# Altium project PCB_Project1.PrjPCB
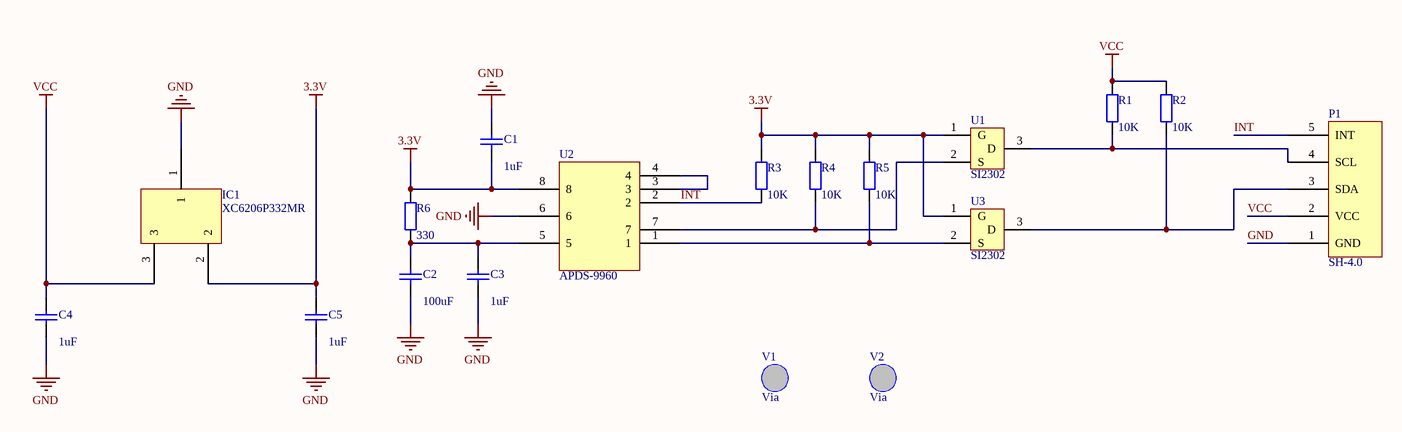
[diagram p0: Sheet1.SchDoc]
1 sheet, 18 parts. Net scope: global (net labels, ports and power ports of the same name join across sheets).
Board file: PCB1.PcbDoc

## Sheet Sheet1.SchDoc
size A4

### Parts
C1  value 1uF  [1608[0603]]  (hidden comment: Cap Semi)
C2  value 100uF  [C2512]  (hidden comment: Cap Semi)
C3  value 1uF  [1608[0603]]  (hidden comment: Cap Semi)
C4  value 1uF  [1608[0603]]  (hidden comment: Cap Semi)
C5  value 1uF  [1608[0603]]  (hidden comment: Cap Semi)
IC1  XC6206P332MR  [SOT-23]
P1  SH-4.0  [SH-4.0]
R1  value 10K  [1608[0603]]  (hidden comment: Res2)
R2  value 10K  [1608[0603]]  (hidden comment: Res2)
R3  value 10K  [1608[0603]]  (hidden comment: Res2)
R4  value 10K  [1608[0603]]  (hidden comment: Res2)
R5  value 10K  [1608[0603]]  (hidden comment: Res2)
R6  value 330  [1608[0603]]  (hidden comment: Res2)
U1  SI2302  [SOT-23]
U2  APDS-9960  [APDS-9960]
U3  SI2302  [SOT-23]
V1  Via  [Via]
V2  Via  [Via]

### Nets
3.3V: C1.2 C5.1 IC1.2 R3.2 R4.2 R5.2 R6.2 U1.1(G) U2.8 U3.1(G)
GND: C1.1 C2.2 C3.2 C4.2 C5.2 IC1.1 P1.1(GND) U2.6
VCC: C4.1 IC1.3 P1.2(VCC) R1.2 R2.2
INT: P1.5(INT) R3.1 U2.2
NetC2_1: C2.1 C3.1 R6.1 U2.5
NetP1_3: P1.3(SDA) R2.1 U3.3(D)
NetP1_4: P1.4(SCL) R1.1 U1.3(D)
NetR4_1: R4.1 U1.2(S) U2.7
NetR5_1: R5.1 U2.1 U3.2(S)
NetU2_3: U2.3 U2.4

### Library data of the parts
C1-C5 = Cap Semi: Capacitor (Semiconductor SIM Model); Published: 8-Jun-2000; LatestRevisionDate: 29-May-2009; LatestRevisionNote: IPC-7351 Footprint Added.; PackageReference: C1206; Publisher: Altium Limited; PackageDescription: Chip Capacitor
R1-R6 = Res2: Resistor; Published: 8-Jun-2000; LatestRevisionDate: 17-Jul-2002; LatestRevisionNote: Re-released for DXP Platform.; PackageReference: AXIAL-0.4; Publisher: Altium Limited; PackageDescription: Axial Device, Thru-Hole; 2 Leads; 0.4 in Pin Spacing
U1 U3 = IRLML2244TRPbF